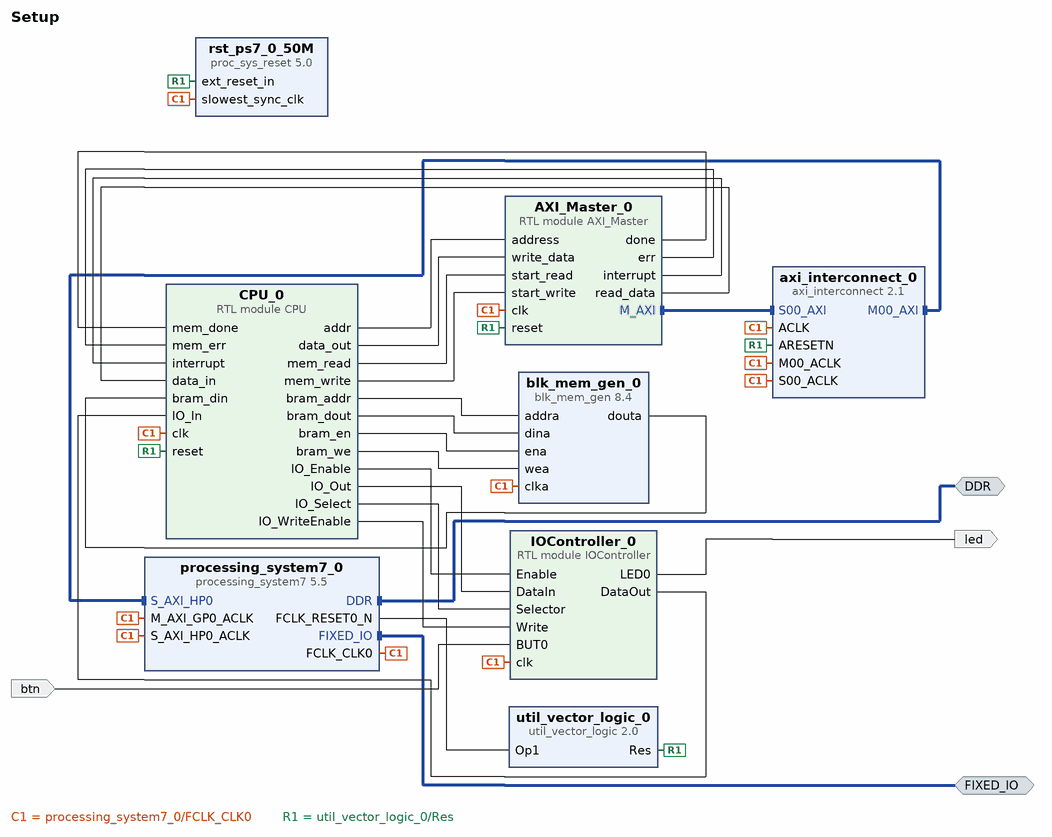
[diagram p0: block diagram of the top level]
# Vivado block design Setup, xc7z020clg484-1, Vivado 2024.1
create_bd_design Setup

create_bd_intf_port -mode Master -vlnv xilinx.com:interface:ddrx_rtl:1.0 DDR
create_bd_intf_port -mode Master -vlnv xilinx.com:display_processing_system7:fixedio_rtl:1.0 FIXED_IO
create_bd_port -dir O led
create_bd_port -dir I btn

create_bd_cell -type ip -vlnv xilinx.com:ip:processing_system7:5.5 processing_system7_0
set_property -dict [list \
  CONFIG.PCW_UART0_PERIPHERAL_ENABLE 1 \
  CONFIG.PCW_UART0_UART0_IO {MIO 50 .. 51} \
  CONFIG.PCW_UART_PERIPHERAL_FREQMHZ 100 \
  CONFIG.PCW_UIPARAM_DDR_BUS_WIDTH {16 Bit} \
  CONFIG.PCW_UIPARAM_DDR_PARTNO {MT41K256M16 RE-125} \
  CONFIG.PCW_USE_S_AXI_HP0 1 \
] [get_bd_cells processing_system7_0]
# 52 more settings of processing_system7_0 are not shown: defaults, MIO pin electricals, DDR timing, and values the tool derives
create_bd_cell -type ip -vlnv xilinx.com:ip:proc_sys_reset:5.0 rst_ps7_0_50M
create_bd_cell -type ip -vlnv xilinx.com:ip:axi_interconnect:2.1 axi_interconnect_0
set_property -dict {CONFIG.ENABLE_ADVANCED_OPTIONS 1 CONFIG.NUM_MI 1} [get_bd_cells axi_interconnect_0]
create_bd_cell -type ip -vlnv xilinx.com:ip:blk_mem_gen:8.4 blk_mem_gen_0
set_property -dict [list \
  CONFIG.Byte_Size 8 \
  CONFIG.Coe_File ../../../../../../../BRAM64.coe \
  CONFIG.Fill_Remaining_Memory_Locations true \
  CONFIG.Load_Init_File true \
  CONFIG.Memory_Type Single_Port_RAM \
  CONFIG.Use_Byte_Write_Enable true \
  CONFIG.Write_Width_A 64 \
  CONFIG.use_bram_block Stand_Alone \
] [get_bd_cells blk_mem_gen_0]
create_bd_cell -type module -reference CPU CPU_0
create_bd_cell -type module -reference AXI_Master AXI_Master_0
create_bd_cell -type ip -vlnv xilinx.com:ip:util_vector_logic:2.0 util_vector_logic_0
set_property -dict {CONFIG.C_OPERATION not CONFIG.C_SIZE 1} [get_bd_cells util_vector_logic_0]
create_bd_cell -type module -reference IOController IOController_0

# ---- connections ----

connect_bd_intf_net [get_bd_intf_pins axi_interconnect_0/S00_AXI] [get_bd_intf_pins AXI_Master_0/M_AXI]
connect_bd_intf_net [get_bd_intf_pins axi_interconnect_0/M00_AXI] [get_bd_intf_pins processing_system7_0/S_AXI_HP0]
connect_bd_intf_net [get_bd_intf_ports DDR] [get_bd_intf_pins processing_system7_0/DDR]
connect_bd_intf_net [get_bd_intf_ports FIXED_IO] [get_bd_intf_pins processing_system7_0/FIXED_IO]
connect_bd_net [get_bd_pins AXI_Master_0/done] [get_bd_pins CPU_0/mem_done]
connect_bd_net [get_bd_pins AXI_Master_0/err] [get_bd_pins CPU_0/mem_err]
connect_bd_net [get_bd_pins AXI_Master_0/interrupt] [get_bd_pins CPU_0/interrupt]
connect_bd_net [get_bd_pins AXI_Master_0/read_data] [get_bd_pins CPU_0/data_in]
connect_bd_net -net BUT0_0_1 [get_bd_ports btn] [get_bd_pins IOController_0/BUT0]
connect_bd_net [get_bd_pins CPU_0/IO_Enable] [get_bd_pins IOController_0/Enable]
connect_bd_net [get_bd_pins CPU_0/IO_Out] [get_bd_pins IOController_0/DataIn]
connect_bd_net [get_bd_pins CPU_0/IO_Select] [get_bd_pins IOController_0/Selector]
connect_bd_net [get_bd_pins CPU_0/IO_WriteEnable] [get_bd_pins IOController_0/Write]
connect_bd_net [get_bd_pins CPU_0/addr] [get_bd_pins AXI_Master_0/address]
connect_bd_net [get_bd_pins CPU_0/bram_addr] [get_bd_pins blk_mem_gen_0/addra]
connect_bd_net [get_bd_pins CPU_0/bram_dout] [get_bd_pins blk_mem_gen_0/dina]
connect_bd_net [get_bd_pins CPU_0/bram_en] [get_bd_pins blk_mem_gen_0/ena]
connect_bd_net [get_bd_pins CPU_0/bram_we] [get_bd_pins blk_mem_gen_0/wea]
connect_bd_net [get_bd_pins CPU_0/data_out] [get_bd_pins AXI_Master_0/write_data]
connect_bd_net [get_bd_pins CPU_0/mem_read] [get_bd_pins AXI_Master_0/start_read]
connect_bd_net [get_bd_pins CPU_0/mem_write] [get_bd_pins AXI_Master_0/start_write]
connect_bd_net [get_bd_pins IOController_0/DataOut] [get_bd_pins CPU_0/IO_In]
connect_bd_net [get_bd_pins IOController_0/LED0] [get_bd_ports led]
connect_bd_net [get_bd_pins blk_mem_gen_0/douta] [get_bd_pins CPU_0/bram_din]
connect_bd_net [get_bd_pins processing_system7_0/FCLK_CLK0] \
  [get_bd_pins rst_ps7_0_50M/slowest_sync_clk] [get_bd_pins processing_system7_0/S_AXI_HP0_ACLK] \
  [get_bd_pins processing_system7_0/M_AXI_GP0_ACLK] [get_bd_pins axi_interconnect_0/ACLK] \
  [get_bd_pins axi_interconnect_0/S00_ACLK] [get_bd_pins axi_interconnect_0/M00_ACLK] [get_bd_pins blk_mem_gen_0/clka] \
  [get_bd_pins CPU_0/clk] [get_bd_pins AXI_Master_0/clk] [get_bd_pins IOController_0/clk]
connect_bd_net [get_bd_pins processing_system7_0/FCLK_RESET0_N] [get_bd_pins util_vector_logic_0/Op1]
connect_bd_net [get_bd_pins util_vector_logic_0/Res] \
  [get_bd_pins rst_ps7_0_50M/ext_reset_in] [get_bd_pins CPU_0/reset] [get_bd_pins axi_interconnect_0/ARESETN] \
  [get_bd_pins AXI_Master_0/reset]

validate_bd_design
save_bd_design
